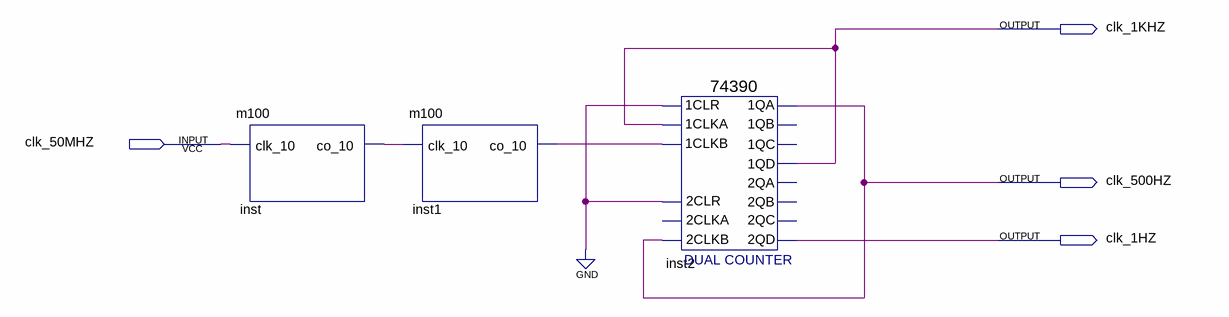
[diagram p0: schematic sheet]
// Quartus schematic PLL_1HZ.bdf as structural Verilog: 3 symbols, 4 pins
module PLL_1HZ (
  input  clk_50MHZ,
  output clk_1KHZ,
  output clk_500HZ,
  output clk_1HZ
);

  wire inst1_co_10, inst_co_10;

  m100 inst (.clk_10(clk_50MHZ), .co_10(inst_co_10));
  m100 inst1 (.clk_10(inst_co_10), .co_10(inst1_co_10));
  \74390  inst2 (
    .\2CLR (1'b0), .\2CLKB (clk_500HZ), .\1CLR (1'b0), .\1CLKA (clk_1KHZ), .\1CLKB (inst1_co_10),
    .\1QA (clk_500HZ), .\1QD (clk_1KHZ), .\2QD (clk_1HZ));  // open: 2CLKA, 1QB, 1QC, 2QA, 2QB, 2QC
endmodule
